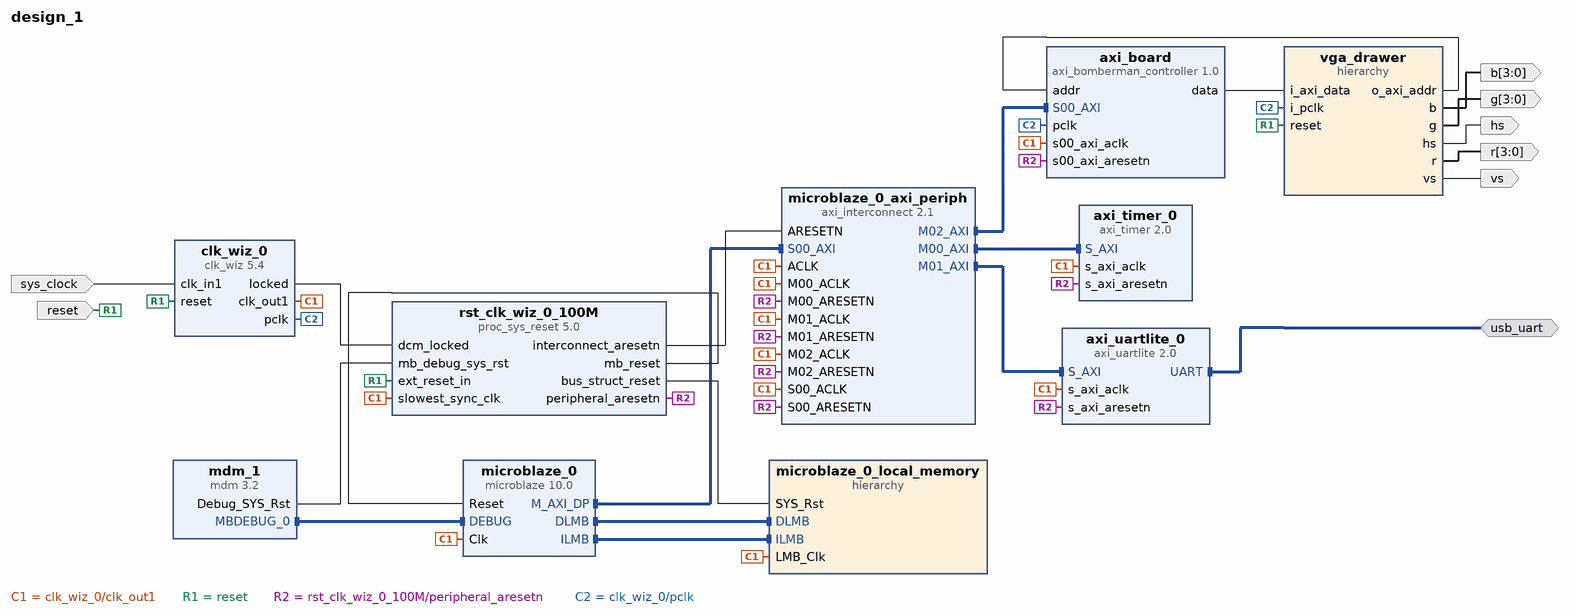
[diagram p0: block diagram of the top level]
# Vivado block design design_1, xc7a35tcpg236-1, Vivado 2017.3
create_bd_design design_1

create_bd_intf_port -mode Master -vlnv xilinx.com:interface:uart_rtl:1.0 usb_uart
create_bd_port -dir I -type rst reset
set_property -dict {CONFIG.POLARITY ACTIVE_HIGH} [get_bd_ports reset]
create_bd_port -dir I -type clk sys_clock
set_property -dict {CONFIG.FREQ_HZ 100000000 CONFIG.PHASE 0.000} [get_bd_ports sys_clock]
create_bd_port -dir O -from 3 -to 0 r
create_bd_port -dir O -from 3 -to 0 g
create_bd_port -dir O -from 3 -to 0 b
create_bd_port -dir O vs
create_bd_port -dir O hs

create_bd_cell -type ip -vlnv xilinx.com:ip:microblaze:10.0 microblaze_0
set_property -dict {CONFIG.C_D_AXI 1 CONFIG.C_D_LMB 1 CONFIG.C_I_LMB 1 CONFIG.C_DEBUG_ENABLED 1} [get_bd_cells microblaze_0]
create_bd_cell -type ip -vlnv xilinx.com:ip:clk_wiz:5.4 clk_wiz_0
set_property -dict [list \
  CONFIG.CLKOUT2_USED true \
  CONFIG.NUM_OUT_CLKS 2 \
  CONFIG.CLK_OUT2_PORT pclk \
  CONFIG.CLKOUT2_REQUESTED_OUT_FREQ 148.5 \
  CONFIG.MMCM_DIVCLK_DIVIDE 1 \
  CONFIG.MMCM_CLKFBOUT_MULT_F 11.875 \
  CONFIG.MMCM_CLKOUT0_DIVIDE_F 11.875 \
  CONFIG.MMCM_CLKOUT1_DIVIDE 8 \
  CONFIG.USE_BOARD_FLOW true \
  CONFIG.CLK_IN1_BOARD_INTERFACE sys_clock \
  CONFIG.RESET_BOARD_INTERFACE reset \
  CONFIG.CLKOUT1_JITTER 116.394 \
  CONFIG.CLKOUT1_PHASE_ERROR 87.466 \
  CONFIG.CLKOUT2_JITTER 108.254 \
  CONFIG.CLKOUT2_PHASE_ERROR 87.466 \
] [get_bd_cells clk_wiz_0]
create_bd_cell -type hier microblaze_0_local_memory
create_bd_cell -type ip -vlnv xilinx.com:ip:mdm:3.2 mdm_1
create_bd_cell -type ip -vlnv xilinx.com:ip:proc_sys_reset:5.0 rst_clk_wiz_0_100M
set_property -dict {CONFIG.USE_BOARD_FLOW true CONFIG.RESET_BOARD_INTERFACE reset} [get_bd_cells rst_clk_wiz_0_100M]
create_bd_cell -type ip -vlnv xilinx.com:ip:axi_timer:2.0 axi_timer_0
create_bd_cell -type ip -vlnv xilinx.com:ip:axi_uartlite:2.0 axi_uartlite_0
set_property -dict {CONFIG.USE_BOARD_FLOW true CONFIG.UARTLITE_BOARD_INTERFACE usb_uart} [get_bd_cells axi_uartlite_0]
create_bd_cell -type ip -vlnv xilinx.com:ip:axi_interconnect:2.1 microblaze_0_axi_periph
set_property -dict {CONFIG.NUM_MI 3} [get_bd_cells microblaze_0_axi_periph]
create_bd_cell -type ip -vlnv xilinx.com:user:axi_bomberman_controller:1.0 axi_board
set_property -dict {CONFIG.ADDR_WIDTH 8 CONFIG.DATA_WIDTH 4 CONFIG.MEMORY_WIDTH 256} [get_bd_cells axi_board]
create_bd_cell -type hier vga_drawer

# ---- hierarchy /microblaze_0_local_memory ----
current_bd_instance /microblaze_0_local_memory
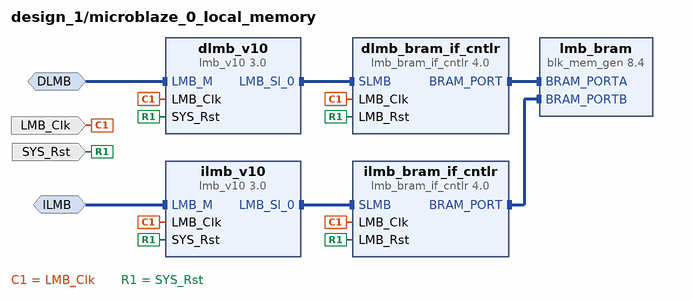
[diagram p1: block diagram inside /microblaze_0_local_memory]
create_bd_intf_pin -mode MirroredMaster -vlnv xilinx.com:interface:lmb_rtl:1.0 DLMB
create_bd_intf_pin -mode MirroredMaster -vlnv xilinx.com:interface:lmb_rtl:1.0 ILMB
create_bd_pin -dir I -type clk LMB_Clk
create_bd_pin -dir I -type rst SYS_Rst

create_bd_cell -type ip -vlnv xilinx.com:ip:lmb_v10:3.0 dlmb_v10
create_bd_cell -type ip -vlnv xilinx.com:ip:lmb_v10:3.0 ilmb_v10
create_bd_cell -type ip -vlnv xilinx.com:ip:lmb_bram_if_cntlr:4.0 dlmb_bram_if_cntlr
set_property -dict {CONFIG.C_ECC 0} [get_bd_cells dlmb_bram_if_cntlr]
create_bd_cell -type ip -vlnv xilinx.com:ip:lmb_bram_if_cntlr:4.0 ilmb_bram_if_cntlr
set_property -dict {CONFIG.C_ECC 0} [get_bd_cells ilmb_bram_if_cntlr]
create_bd_cell -type ip -vlnv xilinx.com:ip:blk_mem_gen:8.4 lmb_bram
set_property -dict {CONFIG.Memory_Type True_Dual_Port_RAM CONFIG.use_bram_block BRAM_Controller} [get_bd_cells lmb_bram]

# ---- hierarchy /vga_drawer ----
current_bd_instance /vga_drawer
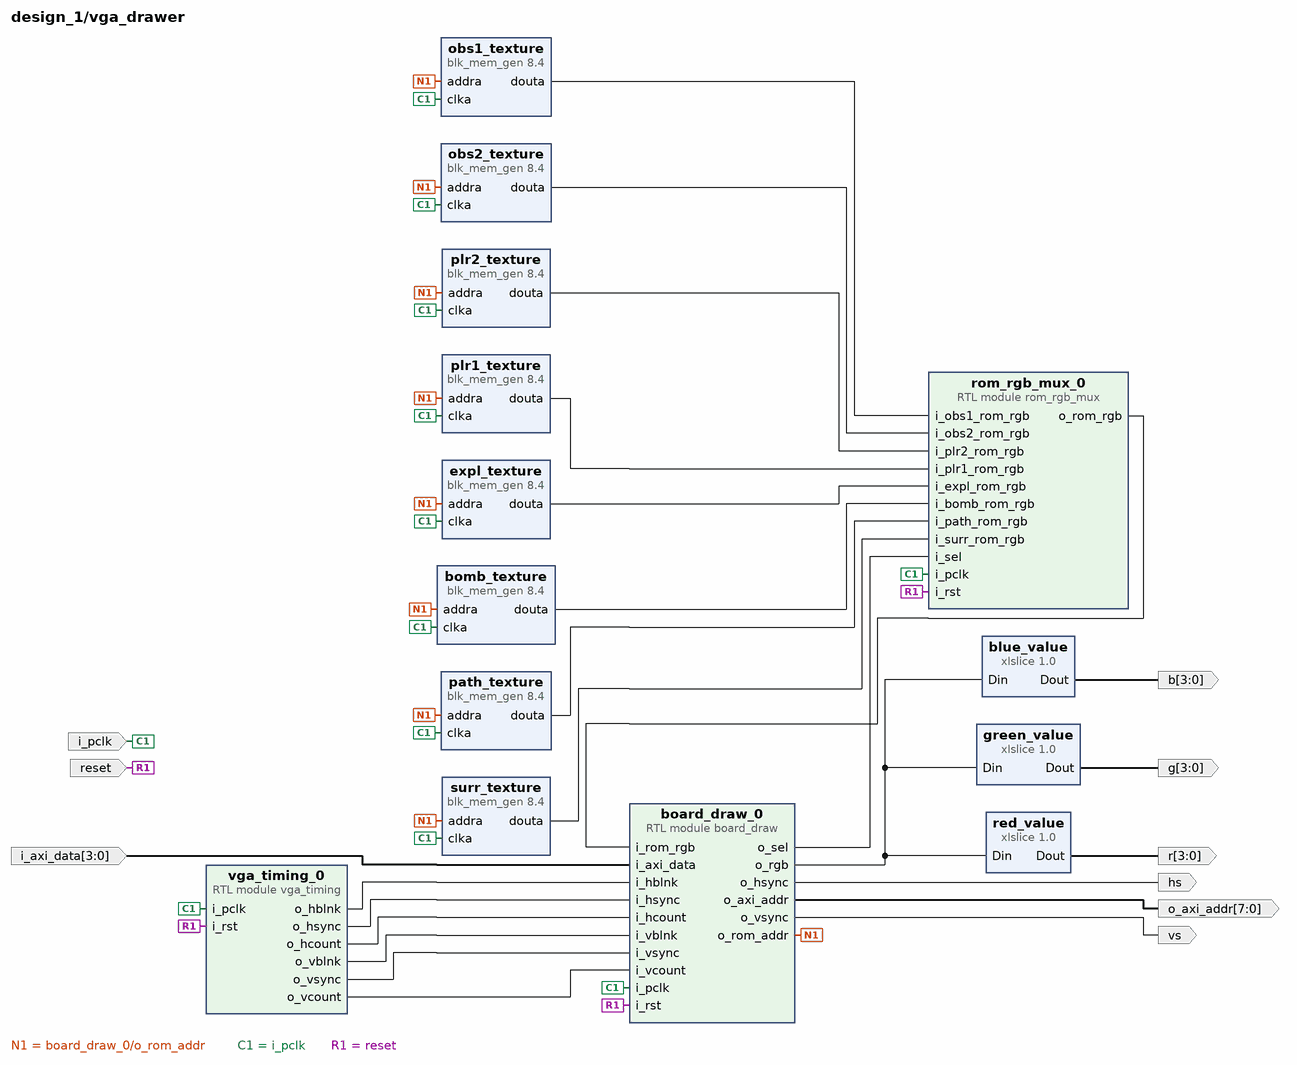
[diagram p2: block diagram inside /vga_drawer]
create_bd_pin -dir I i_pclk
create_bd_pin -dir I -type rst reset
create_bd_pin -dir I -from 3 -to 0 i_axi_data
create_bd_pin -dir O -from 7 -to 0 o_axi_addr
create_bd_pin -dir O -from 3 -to 0 b
create_bd_pin -dir O -from 3 -to 0 g
create_bd_pin -dir O -from 3 -to 0 r
create_bd_pin -dir O hs
create_bd_pin -dir O vs

create_bd_cell -type module -reference vga_timing vga_timing_0
create_bd_cell -type module -reference rom_rgb_mux rom_rgb_mux_0
create_bd_cell -type module -reference board_draw board_draw_0
create_bd_cell -type ip -vlnv xilinx.com:ip:blk_mem_gen:8.4 path_texture
set_property -dict [list \
  CONFIG.Memory_Type Single_Port_ROM \
  CONFIG.Enable_32bit_Address false \
  CONFIG.Write_Width_A 12 \
  CONFIG.Write_Depth_A 4096 \
  CONFIG.Enable_A Always_Enabled \
  CONFIG.Register_PortA_Output_of_Memory_Primitives true \
  CONFIG.Load_Init_File true \
  CONFIG.Coe_File ../../../../src/coe/path.coe \
  CONFIG.Use_RSTA_Pin false \
  CONFIG.Port_A_Write_Rate 0 \
  CONFIG.use_bram_block Stand_Alone \
] [get_bd_cells path_texture]
create_bd_cell -type ip -vlnv xilinx.com:ip:blk_mem_gen:8.4 surr_texture
set_property -dict [list \
  CONFIG.Memory_Type Single_Port_ROM \
  CONFIG.Enable_32bit_Address false \
  CONFIG.Write_Width_A 12 \
  CONFIG.Write_Depth_A 4096 \
  CONFIG.Enable_A Always_Enabled \
  CONFIG.Register_PortA_Output_of_Memory_Primitives true \
  CONFIG.Load_Init_File true \
  CONFIG.Coe_File ../../../../src/coe/surr.coe \
  CONFIG.Use_RSTA_Pin false \
  CONFIG.Port_A_Write_Rate 0 \
  CONFIG.use_bram_block Stand_Alone \
] [get_bd_cells surr_texture]
create_bd_cell -type ip -vlnv xilinx.com:ip:blk_mem_gen:8.4 obs1_texture
set_property -dict [list \
  CONFIG.Memory_Type Single_Port_ROM \
  CONFIG.Enable_32bit_Address false \
  CONFIG.Write_Width_A 12 \
  CONFIG.Write_Depth_A 4096 \
  CONFIG.Enable_A Always_Enabled \
  CONFIG.Register_PortA_Output_of_Memory_Primitives true \
  CONFIG.Load_Init_File true \
  CONFIG.Coe_File ../../../../src/coe/obs1.coe \
  CONFIG.Use_RSTA_Pin false \
  CONFIG.Port_A_Write_Rate 0 \
  CONFIG.use_bram_block Stand_Alone \
] [get_bd_cells obs1_texture]
create_bd_cell -type ip -vlnv xilinx.com:ip:blk_mem_gen:8.4 obs2_texture
set_property -dict [list \
  CONFIG.Memory_Type Single_Port_ROM \
  CONFIG.Enable_32bit_Address false \
  CONFIG.Write_Width_A 12 \
  CONFIG.Write_Depth_A 4096 \
  CONFIG.Enable_A Always_Enabled \
  CONFIG.Register_PortA_Output_of_Memory_Primitives true \
  CONFIG.Load_Init_File true \
  CONFIG.Coe_File ../../../../src/coe/obs2.coe \
  CONFIG.Use_RSTA_Pin false \
  CONFIG.Port_A_Write_Rate 0 \
  CONFIG.use_bram_block Stand_Alone \
] [get_bd_cells obs2_texture]
create_bd_cell -type ip -vlnv xilinx.com:ip:blk_mem_gen:8.4 bomb_texture
set_property -dict [list \
  CONFIG.Memory_Type Single_Port_ROM \
  CONFIG.Enable_32bit_Address false \
  CONFIG.Write_Width_A 12 \
  CONFIG.Write_Depth_A 4096 \
  CONFIG.Enable_A Always_Enabled \
  CONFIG.Register_PortA_Output_of_Memory_Primitives true \
  CONFIG.Load_Init_File true \
  CONFIG.Coe_File ../../../../src/coe/bomb.coe \
  CONFIG.Use_RSTA_Pin false \
  CONFIG.Port_A_Write_Rate 0 \
  CONFIG.use_bram_block Stand_Alone \
] [get_bd_cells bomb_texture]
create_bd_cell -type ip -vlnv xilinx.com:ip:blk_mem_gen:8.4 expl_texture
set_property -dict [list \
  CONFIG.Memory_Type Single_Port_ROM \
  CONFIG.Enable_32bit_Address false \
  CONFIG.Write_Width_A 12 \
  CONFIG.Write_Depth_A 4096 \
  CONFIG.Enable_A Always_Enabled \
  CONFIG.Register_PortA_Output_of_Memory_Primitives true \
  CONFIG.Load_Init_File true \
  CONFIG.Coe_File ../../../../src/coe/expl.coe \
  CONFIG.Use_RSTA_Pin false \
  CONFIG.Port_A_Write_Rate 0 \
  CONFIG.use_bram_block Stand_Alone \
] [get_bd_cells expl_texture]
create_bd_cell -type ip -vlnv xilinx.com:ip:blk_mem_gen:8.4 plr1_texture
set_property -dict [list \
  CONFIG.Memory_Type Single_Port_ROM \
  CONFIG.Enable_32bit_Address false \
  CONFIG.Write_Width_A 12 \
  CONFIG.Write_Depth_A 4096 \
  CONFIG.Enable_A Always_Enabled \
  CONFIG.Register_PortA_Output_of_Memory_Primitives true \
  CONFIG.Load_Init_File true \
  CONFIG.Coe_File ../../../../src/coe/plr1.coe \
  CONFIG.Use_RSTA_Pin false \
  CONFIG.Port_A_Write_Rate 0 \
  CONFIG.use_bram_block Stand_Alone \
] [get_bd_cells plr1_texture]
create_bd_cell -type ip -vlnv xilinx.com:ip:blk_mem_gen:8.4 plr2_texture
set_property -dict [list \
  CONFIG.Memory_Type Single_Port_ROM \
  CONFIG.Enable_32bit_Address false \
  CONFIG.Write_Width_A 12 \
  CONFIG.Write_Depth_A 4096 \
  CONFIG.Enable_A Always_Enabled \
  CONFIG.Register_PortA_Output_of_Memory_Primitives true \
  CONFIG.Load_Init_File true \
  CONFIG.Coe_File ../../../../src/coe/plr2.coe \
  CONFIG.Use_RSTA_Pin false \
  CONFIG.Port_A_Write_Rate 0 \
  CONFIG.use_bram_block Stand_Alone \
] [get_bd_cells plr2_texture]
create_bd_cell -type ip -vlnv xilinx.com:ip:xlslice:1.0 blue_value
set_property -dict {CONFIG.DIN_TO 0 CONFIG.DIN_FROM 3 CONFIG.DIN_WIDTH 12 CONFIG.DOUT_WIDTH 4} [get_bd_cells blue_value]
create_bd_cell -type ip -vlnv xilinx.com:ip:xlslice:1.0 green_value
set_property -dict {CONFIG.DIN_TO 4 CONFIG.DIN_FROM 7 CONFIG.DIN_WIDTH 12 CONFIG.DOUT_WIDTH 4} [get_bd_cells green_value]
create_bd_cell -type ip -vlnv xilinx.com:ip:xlslice:1.0 red_value
set_property -dict {CONFIG.DIN_TO 8 CONFIG.DIN_FROM 11 CONFIG.DIN_WIDTH 12 CONFIG.DOUT_WIDTH 4} [get_bd_cells red_value]

# ---- connections ----

current_bd_instance /microblaze_0_local_memory
connect_bd_intf_net -intf_net microblaze_0_dlmb_bus [get_bd_intf_pins dlmb_v10/LMB_Sl_0] [get_bd_intf_pins dlmb_bram_if_cntlr/SLMB]
connect_bd_intf_net -intf_net microblaze_0_ilmb_bus [get_bd_intf_pins ilmb_v10/LMB_Sl_0] [get_bd_intf_pins ilmb_bram_if_cntlr/SLMB]
connect_bd_intf_net -intf_net microblaze_0_dlmb_cntlr [get_bd_intf_pins dlmb_bram_if_cntlr/BRAM_PORT] [get_bd_intf_pins lmb_bram/BRAM_PORTA]
connect_bd_intf_net -intf_net microblaze_0_ilmb_cntlr [get_bd_intf_pins ilmb_bram_if_cntlr/BRAM_PORT] [get_bd_intf_pins lmb_bram/BRAM_PORTB]
connect_bd_intf_net -intf_net microblaze_0_dlmb [get_bd_intf_pins DLMB] [get_bd_intf_pins dlmb_v10/LMB_M]
connect_bd_intf_net -intf_net microblaze_0_ilmb [get_bd_intf_pins ILMB] [get_bd_intf_pins ilmb_v10/LMB_M]
connect_bd_net -net microblaze_0_Clk [get_bd_pins LMB_Clk] \
  [get_bd_pins dlmb_v10/LMB_Clk] [get_bd_pins dlmb_bram_if_cntlr/LMB_Clk] [get_bd_pins ilmb_v10/LMB_Clk] \
  [get_bd_pins ilmb_bram_if_cntlr/LMB_Clk]
connect_bd_net [get_bd_pins SYS_Rst] \
  [get_bd_pins dlmb_v10/SYS_Rst] [get_bd_pins dlmb_bram_if_cntlr/LMB_Rst] [get_bd_pins ilmb_v10/SYS_Rst] \
  [get_bd_pins ilmb_bram_if_cntlr/LMB_Rst]

current_bd_instance /vga_drawer
connect_bd_net [get_bd_pins obs1_texture/douta] [get_bd_pins rom_rgb_mux_0/i_obs1_rom_rgb]
connect_bd_net [get_bd_pins obs2_texture/douta] [get_bd_pins rom_rgb_mux_0/i_obs2_rom_rgb]
connect_bd_net [get_bd_pins plr2_texture/douta] [get_bd_pins rom_rgb_mux_0/i_plr2_rom_rgb]
connect_bd_net [get_bd_pins plr1_texture/douta] [get_bd_pins rom_rgb_mux_0/i_plr1_rom_rgb]
connect_bd_net [get_bd_pins expl_texture/douta] [get_bd_pins rom_rgb_mux_0/i_expl_rom_rgb]
connect_bd_net [get_bd_pins bomb_texture/douta] [get_bd_pins rom_rgb_mux_0/i_bomb_rom_rgb]
connect_bd_net [get_bd_pins path_texture/douta] [get_bd_pins rom_rgb_mux_0/i_path_rom_rgb]
connect_bd_net [get_bd_pins surr_texture/douta] [get_bd_pins rom_rgb_mux_0/i_surr_rom_rgb]
connect_bd_net [get_bd_pins rom_rgb_mux_0/o_rom_rgb] [get_bd_pins board_draw_0/i_rom_rgb]
connect_bd_net [get_bd_pins vga_timing_0/o_hblnk] [get_bd_pins board_draw_0/i_hblnk]
connect_bd_net [get_bd_pins vga_timing_0/o_hsync] [get_bd_pins board_draw_0/i_hsync]
connect_bd_net [get_bd_pins vga_timing_0/o_hcount] [get_bd_pins board_draw_0/i_hcount]
connect_bd_net [get_bd_pins vga_timing_0/o_vblnk] [get_bd_pins board_draw_0/i_vblnk]
connect_bd_net [get_bd_pins vga_timing_0/o_vsync] [get_bd_pins board_draw_0/i_vsync]
connect_bd_net [get_bd_pins vga_timing_0/o_vcount] [get_bd_pins board_draw_0/i_vcount]
connect_bd_net [get_bd_pins board_draw_0/o_rgb] [get_bd_pins blue_value/Din] [get_bd_pins green_value/Din] [get_bd_pins red_value/Din]
connect_bd_net [get_bd_pins board_draw_0/o_rom_addr] \
  [get_bd_pins surr_texture/addra] [get_bd_pins bomb_texture/addra] [get_bd_pins expl_texture/addra] \
  [get_bd_pins plr1_texture/addra] [get_bd_pins plr2_texture/addra] [get_bd_pins path_texture/addra] \
  [get_bd_pins obs2_texture/addra] [get_bd_pins obs1_texture/addra]
connect_bd_net [get_bd_pins i_pclk] \
  [get_bd_pins board_draw_0/i_pclk] [get_bd_pins vga_timing_0/i_pclk] [get_bd_pins rom_rgb_mux_0/i_pclk] \
  [get_bd_pins obs1_texture/clka] [get_bd_pins bomb_texture/clka] [get_bd_pins obs2_texture/clka] \
  [get_bd_pins expl_texture/clka] [get_bd_pins path_texture/clka] [get_bd_pins plr1_texture/clka] \
  [get_bd_pins plr2_texture/clka] [get_bd_pins surr_texture/clka]
connect_bd_net [get_bd_pins reset] [get_bd_pins board_draw_0/i_rst] [get_bd_pins vga_timing_0/i_rst] [get_bd_pins rom_rgb_mux_0/i_rst]
connect_bd_net [get_bd_pins i_axi_data] [get_bd_pins board_draw_0/i_axi_data]
connect_bd_net [get_bd_pins board_draw_0/o_sel] [get_bd_pins rom_rgb_mux_0/i_sel]
connect_bd_net [get_bd_pins board_draw_0/o_axi_addr] [get_bd_pins o_axi_addr]
connect_bd_net [get_bd_pins blue_value/Dout] [get_bd_pins b]
connect_bd_net [get_bd_pins green_value/Dout] [get_bd_pins g]
connect_bd_net [get_bd_pins red_value/Dout] [get_bd_pins r]
connect_bd_net [get_bd_pins board_draw_0/o_hsync] [get_bd_pins hs]
connect_bd_net [get_bd_pins board_draw_0/o_vsync] [get_bd_pins vs]

current_bd_instance /
connect_bd_intf_net [get_bd_intf_pins microblaze_0/DLMB] [get_bd_intf_pins microblaze_0_local_memory/DLMB]
connect_bd_intf_net [get_bd_intf_pins microblaze_0/ILMB] [get_bd_intf_pins microblaze_0_local_memory/ILMB]
connect_bd_intf_net [get_bd_intf_pins mdm_1/MBDEBUG_0] [get_bd_intf_pins microblaze_0/DEBUG]
connect_bd_intf_net [get_bd_intf_pins microblaze_0/M_AXI_DP] [get_bd_intf_pins microblaze_0_axi_periph/S00_AXI]
connect_bd_intf_net [get_bd_intf_pins microblaze_0_axi_periph/M00_AXI] [get_bd_intf_pins axi_timer_0/S_AXI]
connect_bd_intf_net [get_bd_intf_pins microblaze_0_axi_periph/M01_AXI] [get_bd_intf_pins axi_uartlite_0/S_AXI]
connect_bd_intf_net [get_bd_intf_pins microblaze_0_axi_periph/M02_AXI] [get_bd_intf_pins axi_board/S00_AXI]
connect_bd_intf_net [get_bd_intf_ports usb_uart] [get_bd_intf_pins axi_uartlite_0/UART]
connect_bd_net -net microblaze_0_Clk [get_bd_pins clk_wiz_0/clk_out1] \
  [get_bd_pins microblaze_0/Clk] [get_bd_pins microblaze_0_local_memory/LMB_Clk] \
  [get_bd_pins rst_clk_wiz_0_100M/slowest_sync_clk] [get_bd_pins microblaze_0_axi_periph/S00_ACLK] \
  [get_bd_pins axi_timer_0/s_axi_aclk] [get_bd_pins microblaze_0_axi_periph/M00_ACLK] \
  [get_bd_pins microblaze_0_axi_periph/ACLK] [get_bd_pins axi_uartlite_0/s_axi_aclk] \
  [get_bd_pins microblaze_0_axi_periph/M01_ACLK] [get_bd_pins axi_board/s00_axi_aclk] \
  [get_bd_pins microblaze_0_axi_periph/M02_ACLK]
connect_bd_net [get_bd_pins clk_wiz_0/locked] [get_bd_pins rst_clk_wiz_0_100M/dcm_locked]
connect_bd_net [get_bd_pins rst_clk_wiz_0_100M/mb_reset] [get_bd_pins microblaze_0/Reset]
connect_bd_net [get_bd_pins rst_clk_wiz_0_100M/bus_struct_reset] [get_bd_pins microblaze_0_local_memory/SYS_Rst]
connect_bd_net [get_bd_pins mdm_1/Debug_SYS_Rst] [get_bd_pins rst_clk_wiz_0_100M/mb_debug_sys_rst]
connect_bd_net [get_bd_ports reset] [get_bd_pins clk_wiz_0/reset] [get_bd_pins rst_clk_wiz_0_100M/ext_reset_in] [get_bd_pins vga_drawer/reset]
connect_bd_net [get_bd_ports sys_clock] [get_bd_pins clk_wiz_0/clk_in1]
connect_bd_net [get_bd_pins rst_clk_wiz_0_100M/peripheral_aresetn] \
  [get_bd_pins microblaze_0_axi_periph/S00_ARESETN] [get_bd_pins axi_timer_0/s_axi_aresetn] \
  [get_bd_pins microblaze_0_axi_periph/M00_ARESETN] [get_bd_pins axi_uartlite_0/s_axi_aresetn] \
  [get_bd_pins microblaze_0_axi_periph/M01_ARESETN] [get_bd_pins axi_board/s00_axi_aresetn] \
  [get_bd_pins microblaze_0_axi_periph/M02_ARESETN]
connect_bd_net [get_bd_pins rst_clk_wiz_0_100M/interconnect_aresetn] [get_bd_pins microblaze_0_axi_periph/ARESETN]
connect_bd_net [get_bd_pins clk_wiz_0/pclk] [get_bd_pins axi_board/pclk] [get_bd_pins vga_drawer/i_pclk]
connect_bd_net -net axi_bomberman_controller_0_data [get_bd_pins axi_board/data] [get_bd_pins vga_drawer/i_axi_data]
connect_bd_net [get_bd_pins vga_drawer/o_axi_addr] [get_bd_pins axi_board/addr]
connect_bd_net [get_bd_pins vga_drawer/b] [get_bd_ports b]
connect_bd_net [get_bd_pins vga_drawer/g] [get_bd_ports g]
connect_bd_net [get_bd_pins vga_drawer/r] [get_bd_ports r]
connect_bd_net [get_bd_pins vga_drawer/hs] [get_bd_ports hs]
connect_bd_net [get_bd_pins vga_drawer/vs] [get_bd_ports vs]

# ---- address map ----
assign_bd_address -offset 0x00000000 -range 128K -target_address_space [get_bd_addr_spaces microblaze_0/Data] [get_bd_addr_segs microblaze_0_local_memory/dlmb_bram_if_cntlr/SLMB/Mem]
assign_bd_address -offset 0x40600000 -range 64K -target_address_space [get_bd_addr_spaces microblaze_0/Data] [get_bd_addr_segs axi_uartlite_0/S_AXI/Reg]
assign_bd_address -offset 0x41C00000 -range 64K -target_address_space [get_bd_addr_spaces microblaze_0/Data] [get_bd_addr_segs axi_timer_0/S_AXI/Reg]
assign_bd_address -offset 0x44A00000 -range 64K -target_address_space [get_bd_addr_spaces microblaze_0/Data] [get_bd_addr_segs axi_board/S00_AXI/S00_AXI_reg]
assign_bd_address -offset 0x00000000 -range 128K -target_address_space [get_bd_addr_spaces microblaze_0/Instruction] [get_bd_addr_segs microblaze_0_local_memory/ilmb_bram_if_cntlr/SLMB/Mem]

validate_bd_design
save_bd_design
